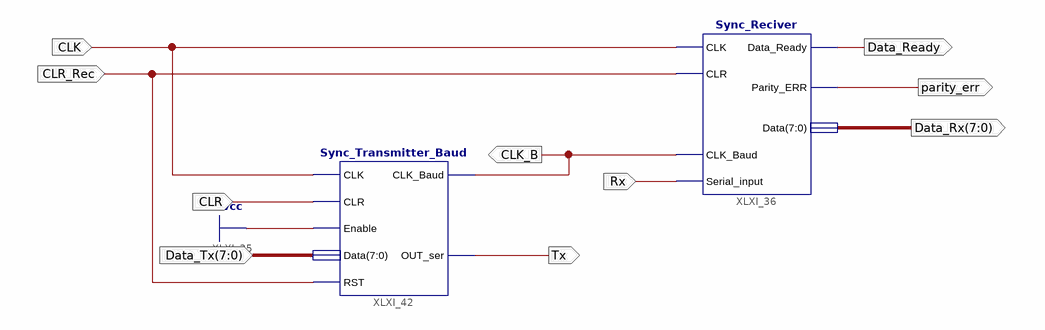
[diagram p0: schematic sheet 1]
// Xilinx ISE schematic test_usart.sch (spartan3e) as structural Verilog: 2 symbols, 10 ports
module test_usart (
  input  CLK,
  input  CLR,
  input  Rx,
  input  [7:0] Data_Tx,
  input  CLR_Rec,
  output CLK_B,
  output parity_err,
  output [7:0] Data_Rx,
  output Tx,
  output Data_Ready
);

  Sync_Reciver XLXI_36 (
    .CLK(CLK), .CLR(CLR_Rec), .CLK_Baud(CLK_B), .Serial_input(Rx), .Data_Ready(Data_Ready),
    .Parity_ERR(parity_err), .Data(Data_Rx));
  Sync_Transmitter_Baud XLXI_42 (
    .CLK(CLK), .CLR(CLR), .Enable(1'b1), .RST(CLR_Rec), .Data(Data_Tx), .CLK_Baud(CLK_B), .OUT_ser(Tx));
endmodule
